# Altium schematic sheet Sheet1.SchDoc
size 381 x 241 mm
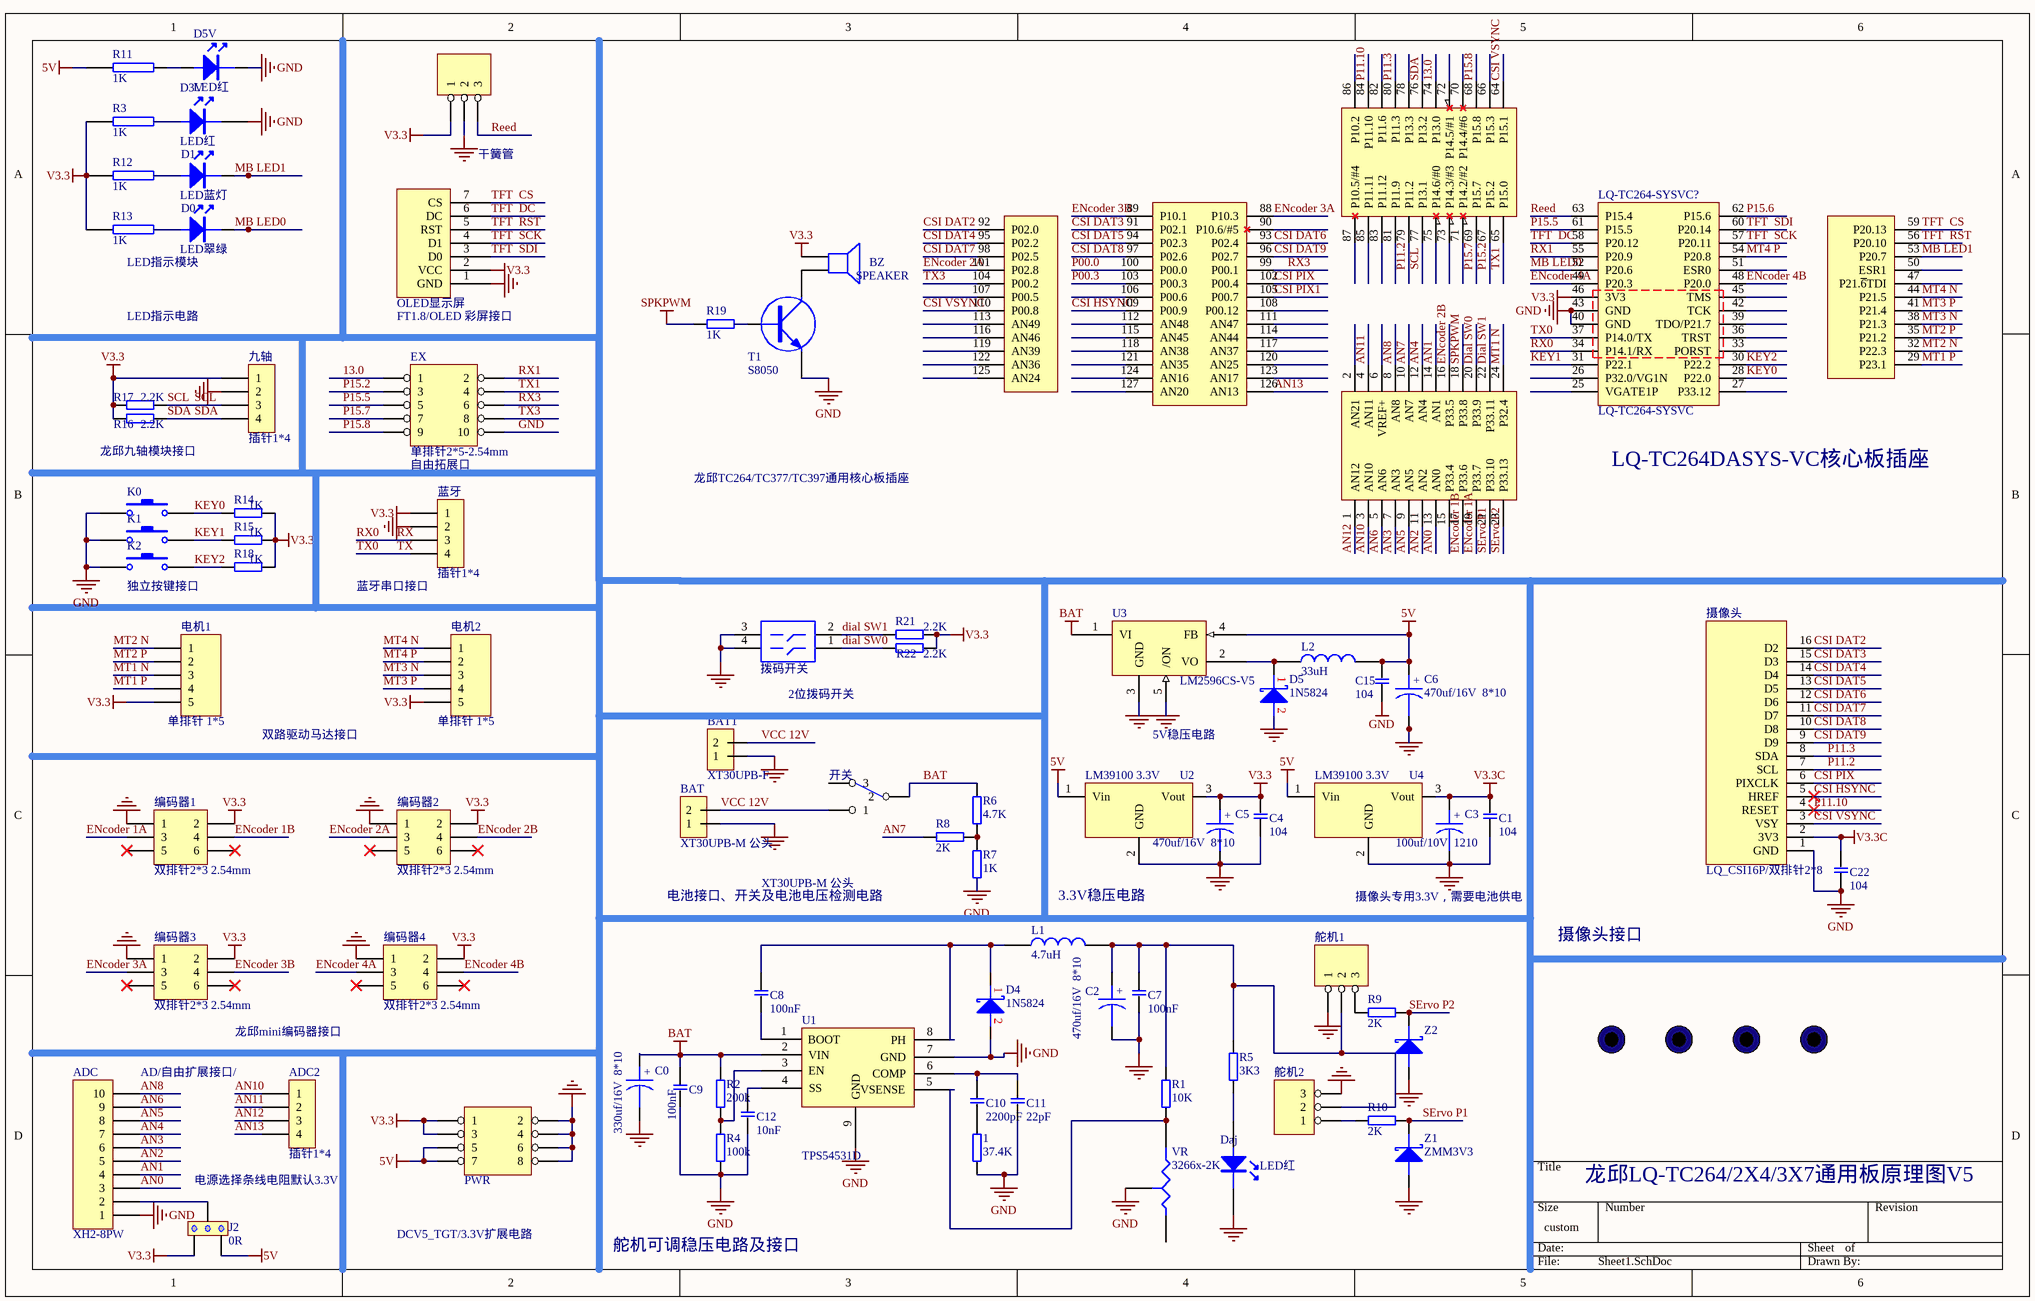
[diagram p0: Sheet1.SchDoc]

## Parts
1  37.4K  [LQ_R0603]
ADC  XH2-8PW  [LQ_IDC5X2]
ADC2  插针1*4  [LQ_XH254-4P]
BAT  XT30UPB-M 公头  [LQ_XT30UPB-F]
BAT1  XT30UPB-F  [LQ_KF301-2P]
BZ  SPEAKER  [LQ_BUZZER9]
C0  330uf/16V  8*10  [LQ_C8X10]
C1  104  [LQ_C0603]
C2  470uf/16V  8*10  [LQ_C8X10]
C3  100uf/10V  1210  [LQ_C8X10]
C4  104  [LQ_C0603]
C5  470uf/16V  8*10  [LQ_C8X10]
C6  470uf/16V  8*10  [LQ_C8X10]
C7  100nF  [LQ_C0603]
C8  100nF  [LQ_C0603]
C9  100nF  [LQ_C0603]
C10  2200pF  [LQ_C0603]
C11  22pF  [LQ_C0603]
C12  10nF  [LQ_C0603]
C15  104  [LQ_C0603]
C22  104  [LQ_C0603]
D0  LED翠绿  [LQ_LED0603R]
D1  LED蓝灯  [LQ_LED0603R]
D3V  LED红  [LQ_LED0603R]
D4  1N5824  [LQ_D1812Z]
D5  1N5824  [LQ_D1812Z]
D5V  LED红  [LQ_LED0603R]
Daj  LED红  [LQ_LED0603R]
EX  单排针2*5-2.54mm  [LQ_IDC5X2]
J2  0R  [LQ_0603JUMP]
K0  微动开关6*6*6  [LQ_BT4SMT]  (value not drawn)
K1  微动开关6*6*6  [LQ_BT4SMT]  (value not drawn)
K2  微动开关6*6*6  [LQ_BT4SMT]  (value not drawn)
L1  4.7uH  [LQ_L7X7]
L2  33uH  [LQ_L7X7]
LQ-TC264-SYSVC?  LQ-TC264-SYSVC  [LQ-TC264-SYSVC-S]
OLED显示屏  单排座1*7-2.54  [LQ-TFT-180V33]  (value not drawn)
PWR  双排针4X2-2.54  [LQ_IDC4X2]  (value not drawn)
R1  10K  [LQ_R0603]
R2  200k  [LQ_R0603]
R3  1K  [LQ_R0603]
R4  100k  [LQ_R0603]
R5  3K3  [LQ_R0603]
R6  4.7K  [LQ_R0603]
R7  1K  [LQ_R0603]
R8  2K  [LQ_R0603]
R9  2K  [LQ_R0603]
R10  2K  [LQ_R0603]
R11  1K  [LQ_R0603]
R12  1K  [LQ_R0603]
R13  1K  [LQ_R0603]
R14  1K  [LQ_R0603]
R15  1K  [LQ_R0603]
R16  2.2K  [LQ_R0603]
R17  2.2K  [LQ_R0603]
R18  1K  [LQ_R0603]
R19  1K  [LQ_R0603]
R21  2.2K  [LQ_R0603]
R22  2.2K  [LQ_R0603]
SCROW1  SCROW  [LQ_SCROW3&5mm]  (value not drawn)
SCROW2  SCROW  [LQ_SCROW3&5mm]  (value not drawn)
SCROW3  SCROW  [LQ_SCROW3&5mm]  (value not drawn)
SCROW4  SCROW  [LQ_SCROW3&5mm]  (value not drawn)
T1  S8050  [LQ_SOT-23NPN]
U1  TPS54531D  [LQ_SOP8S-p]
U2  LM39100 3.3V  [SOT223_M]
U3  LM2596CS-V5  [LQ_TO-263-5]
U4  LM39100 3.3V  [SOT223_M]
VR  3266x-2K  [lq_3266]
Z1  ZMM3V3  [LQ_1206D]
Z2  ZMM3V3  [LQ_1206D]  (value not drawn)
九轴  插针1*4  [LQ_XH254-4P]
干簧管  XH254-3P  [LQ_XH254-3P]  (value not drawn)
开关  KCD1-101 117S  [LQ_KCD1-101 117S]  (value not drawn)
拨码开关  SW-DIP2  [DIP4]  (value not drawn)
摄像头  LQ_CSI16P/双排针2*8  [LQ_IDC8X2]
电机1  XH254-4P  [LQ_XH254-5P]  (value not drawn)
电机2  XH254-4P  [LQ_XH254-5P]  (value not drawn)
编码器1  双排针2*3 2.54mm  [LQ_ENCODER]
编码器2  双排针2*3 2.54mm  [LQ_ENCODER]
编码器3  双排针2*3 2.54mm  [LQ_ENCODER]
编码器4  双排针2*3 2.54mm  [LQ_ENCODER]
舵机1  XH254-3P  [LQ_XH254-3P]  (value not drawn)
舵机2  XH254-3P  [LQ_XH254-3P]  (value not drawn)
蓝牙  插针1*4  [LQ_XH254-4P]

## Nets
5V: C6.1 C15.1 J2.3 L2.2 PWR.5 PWR.7 R11.1 U2.1(Vin) U3.4(FB) U4.1(Vin)
BAT: C0.1 C9.2 R2.1 R6.1 U1.2(VIN) U3.1(VI) 开关.2
GND: 1.2 ADC.1 BAT.1 BAT1.1 C0.2 C1.2 C2.2 C3.2 C4.2 C5.2 C6.2 C7.1 C9.1 C11.1 C12.1 C15.2 C22.2 D3V.2 D4.2 D5.2 D5V.2 Daj.2 EX.10 K0.1 K1.1 K2.1 LQ-TC264-SYSVC?.40(GND) LQ-TC264-SYSVC?.43(GND) OLED显示屏.1(GND) PWR.2 PWR.4 PWR.6 PWR.8 R4.2 R7.2 T1.3(E) U1.7(GND) U1.9(GND) U2.2(GND) U3.3(GND) U3.5(/ON) U4.2(GND) VR.3(TAP) Z1.1 Z2.1 九轴.2 干簧管.2 拨码开关.3 拨码开关.4 摄像头.1(GND) 编码器1.1 编码器2.1 编码器3.1 编码器4.1 舵机1.1 舵机2.3 蓝牙.2
SPKPWM: LQ-TC264-SYSVC?.18(P33.8) R19.1
V3.3: BZ.1 C4.1 C5.1 J2.1 LQ-TC264-SYSVC?.46(3V3) OLED显示屏.2(VCC) PWR.1 PWR.3 R3.1 R12.1 R13.1 R14.2 R15.2 R16.1 R17.1 R18.2 R21.2 R22.2 U2.3(Vout) 九轴.1 干簧管.1 电机1.5 电机2.5 编码器1.2 编码器2.2 编码器3.2 编码器4.2 蓝牙.1
V3.3C: C1.1 C3.1 C22.1 U4.3(Vout) 摄像头.2(3V3)
13.0: EX.1 LQ-TC264-SYSVC?.74(P13.0)
AN0: ADC.3 LQ-TC264-SYSVC?.13(AN0)
AN1: ADC.4 LQ-TC264-SYSVC?.14(AN1)
AN2: ADC.5 LQ-TC264-SYSVC?.11(AN2)
AN3: ADC.6 LQ-TC264-SYSVC?.7(AN3)
AN4: ADC.7 LQ-TC264-SYSVC?.12(AN4)
AN5: ADC.8 LQ-TC264-SYSVC?.9(AN5)
AN6: ADC.9 LQ-TC264-SYSVC?.5(AN6)
AN7: LQ-TC264-SYSVC?.10(AN7) R8.1
AN8: ADC.10 LQ-TC264-SYSVC?.8(AN8)
AN10: ADC2.1 LQ-TC264-SYSVC?.3(AN10)
AN11: ADC2.2 LQ-TC264-SYSVC?.4(AN11)
AN12: ADC2.3 LQ-TC264-SYSVC?.1(AN12)
AN13: ADC2.4 LQ-TC264-SYSVC?.126(AN13)
CSI DAT2: LQ-TC264-SYSVC?.92(P02.0) 摄像头.16(D2)
CSI DAT3: LQ-TC264-SYSVC?.91(P02.1) 摄像头.15(D3)
CSI DAT4: LQ-TC264-SYSVC?.95(P02.2) 摄像头.14(D4)
CSI DAT5: LQ-TC264-SYSVC?.94(P02.3) 摄像头.13(D5)
CSI DAT6: LQ-TC264-SYSVC?.93(P02.4) 摄像头.12(D6)
CSI DAT7: LQ-TC264-SYSVC?.98(P02.5) 摄像头.11(D7)
CSI DAT8: LQ-TC264-SYSVC?.97(P02.6) 摄像头.10(D8)
CSI DAT9: LQ-TC264-SYSVC?.96(P02.7) 摄像头.9(D9)
CSI HSYNC: LQ-TC264-SYSVC?.109(P00.9) 摄像头.5(HREF)
CSI PIX: LQ-TC264-SYSVC?.102(P00.4) 摄像头.6(PIXCLK)
CSI PIX1: LQ-TC264-SYSVC?.105(P00.7)
CSI VSYNC: LQ-TC264-SYSVC?.64(P15.1) LQ-TC264-SYSVC?.110(P00.8) 摄像头.3(VSY)
Dial SW0: LQ-TC264-SYSVC?.20(P33.9) R22.1 拨码开关.1
Dial SW1: LQ-TC264-SYSVC?.22(P33.11) R21.1 拨码开关.2
ENcoder 1A: LQ-TC264-SYSVC?.19(P33.7) 编码器1.3
ENcoder 1B: LQ-TC264-SYSVC?.17(P33.6) 编码器1.4
ENcoder 2A: LQ-TC264-SYSVC?.101(P02.8) 编码器2.3
ENcoder 2B: LQ-TC264-SYSVC?.16(P33.5) 编码器2.4
ENcoder 3A: LQ-TC264-SYSVC?.88(P10.3) 编码器3.3
ENcoder 3B: LQ-TC264-SYSVC?.89(P10.1) 编码器3.4
ENcoder 4A: LQ-TC264-SYSVC?.49(P20.3) 编码器4.3
ENcoder 4B: LQ-TC264-SYSVC?.48(P20.0) 编码器4.4
KEY0: K0.2 LQ-TC264-SYSVC?.28(P22.0) R14.1
KEY1: K1.2 LQ-TC264-SYSVC?.31(P22.1) R15.1
KEY2: K2.2 LQ-TC264-SYSVC?.30(P22.2) R18.1
MB LED0: D0.2 LQ-TC264-SYSVC?.52(P20.6)
MB LED1: D1.2 LQ-TC264-SYSVC?.53(P20.7)
MT1 N: LQ-TC264-SYSVC?.24(P32.4) 电机1.3
MT1 P: LQ-TC264-SYSVC?.29(P23.1) 电机1.4
MT2 N: LQ-TC264-SYSVC?.32(P22.3) 电机1.1
MT2 P: LQ-TC264-SYSVC?.35(P21.2) 电机1.2
MT3 N: LQ-TC264-SYSVC?.38(P21.3) 电机2.3
MT3 P: LQ-TC264-SYSVC?.41(P21.4) 电机2.4
MT4 N: LQ-TC264-SYSVC?.44(P21.5) 电机2.1
MT4 P: LQ-TC264-SYSVC?.54(P20.8) 电机2.2
P00.0: LQ-TC264-SYSVC?.100(P00.0)
P00.3: LQ-TC264-SYSVC?.103(P00.3)
P11.2: LQ-TC264-SYSVC?.79(P11.2) 摄像头.7(SCL)
P11.3: LQ-TC264-SYSVC?.80(P11.3) 摄像头.8(SDA)
P11.10: LQ-TC264-SYSVC?.84(P11.10) 摄像头.4(RESET)
P15.2: EX.3 LQ-TC264-SYSVC?.67(P15.2)
P15.5: EX.5 LQ-TC264-SYSVC?.61(P15.5)
P15.6: LQ-TC264-SYSVC?.62(P15.6)
P15.7: EX.7 LQ-TC264-SYSVC?.69(P15.7)
P15.8: EX.9 LQ-TC264-SYSVC?.68(P15.8)
Reed: LQ-TC264-SYSVC?.63(P15.4) 干簧管.3
RX: LQ-TC264-SYSVC?.34(P14.1/RX) 蓝牙.3  [also labelled RX0]
RX1: EX.2 LQ-TC264-SYSVC?.55(P20.9)
RX3: EX.6 LQ-TC264-SYSVC?.99(P00.1)
SCL: LQ-TC264-SYSVC?.77(P13.1) R17.2 九轴.3
SDA: LQ-TC264-SYSVC?.76(P13.2) R16.2 九轴.4
SErvo P1: LQ-TC264-SYSVC?.21(P33.10) R10.2 Z1.2
SErvo P2: LQ-TC264-SYSVC?.23(P33.13) R9.2 Z2.2
TFT  CS: LQ-TC264-SYSVC?.59(P20.13) OLED显示屏.7(CS)
TFT  DC: LQ-TC264-SYSVC?.58(P20.12) OLED显示屏.6(DC)
TFT  RST: LQ-TC264-SYSVC?.56(P20.10) OLED显示屏.5(RST)
TFT  SCK: LQ-TC264-SYSVC?.57(P20.11) OLED显示屏.4(D1)
TFT  SDI: LQ-TC264-SYSVC?.60(P20.14) OLED显示屏.3(D0)
TX: LQ-TC264-SYSVC?.37(P14.0/TX) 蓝牙.4  [also labelled TX0]
TX1: EX.4 LQ-TC264-SYSVC?.65(P15.0)
TX3: EX.8 LQ-TC264-SYSVC?.104(P00.2)
VCC 12V: BAT.2 BAT1.2 开关.1
Net1_1: 1.1 C10.1
NetADC_2: ADC.2 J2.2
NetBZ_2: BZ.2 T1.2(C)
NetC2_1: C2.1 C7.2 L1.2 R1.1 R5.1 舵机1.2 舵机2.2
NetC8_1: C8.1 U1.1(BOOT)
NetC8_2: C8.2 D4.1 L1.1 U1.8(PH)
NetC10_2: C10.2 C11.2 U1.6(COMP)
NetC12_2: C12.2 U1.4(SS)
NetD0_1: D0.1 R13.2
NetD1_1: D1.1 R12.2
NetD3V_1: D3V.1 R3.2
NetD5_1: D5.1 L2.1 U3.2(VO)
NetD5V_1: D5V.1 R11.2
NetDaj_1: Daj.1 R5.2
NetR1_2: R1.2 U1.5(VSENSE) VR.2(B)
NetR2_2: R2.2 R4.1 U1.3(EN)
NetR6_2: R6.2 R7.1 R8.2
NetR9_1: R9.1 舵机1.3
NetR10_1: R10.1 舵机2.1
NetR19_2: R19.2 T1.1(B)

Not connected (* = marked no-connect by the designer): LQ-TC264-SYSVC? 2(AN21) 6(VREF+) 15(P33.4) 25(VGATE1P) 26(P32.0/VG1N) 27(P33.12) 33(PORST) 36(TRST) 39(TDO/P21.7) 42(TCK) 45(TMS) 47(P21.~{6}TDI) 50(ESR1) 51(ESR0) 66(P15.3) 70(P14.4/#6) 71(P14.2/#2) 72(P14.5/#1) 73(P14.3/#3) 75(P14.6/#0) 78(P13.3) 81(P11.9) 82(P11.6) 83(P11.12) 85(P11.11) 86(P10.2) 87(P10.5/#4) 90(P10.6/#5) 106(P00.6) 107(P00.5) 108(P00.12) 111(AN47) 112(AN48) 113(AN49) 114(AN44) 115(AN45) 116(AN46) 117(AN37) 118(AN38) 119(AN39) 120(AN25) 121(AN35) 122(AN36) 123(AN17) 124(AN16) 125(AN24) 127(AN20); SCROW1 1; SCROW2 1; SCROW3 1; SCROW4 1; VR 1(A); 开关 3; 编码器1 5* 6*; 编码器2 5* 6*; 编码器3 5* 6*; 编码器4 5* 6*

## Notes on the sheet
- LED指示模块
- LED指示电路
- (near OLED显示屏) FT1.8/OLED 彩屏接口
- 龙邱九轴模块接口
- 自由拓展口
- 龙邱TC264/TC377/TC397通用核心板插座
- (near LQ-TC264-SYSVC?) LQ-TC264DASYS-VC核心板插座
- (near K2) 独立按键接口
- 蓝牙串口接口
- (near 拨码开关) 2位拨码开关
- (near 电机1) 单排针 1*5
- 双路驱动马达接口
- (near 电机2) 单排针 1*5
- 5V稳压电路
- 电池接口、开关及电池电压检测电路
- XT30UPB-M 公头
- 3.3V稳压电路
- 摄像头专用3.3V，需要电池供电
- 摄像头接口
- 龙邱mini编码器接口
- (near ADC) AD/自由扩展接口/
- 电源选择条线电阻默认3.3V
- 龙邱LQ-TC264/2X4/3X7通用板原理图V5
- DCV5_TGT/3.3V扩展电路
- 舵机可调稳压电路及接口
- (in symbol CAPACITOR POL) +

## Library data of the parts
1 R1 R2 R4-R10 R14-R19 R21 R22 = LQ_RES: RES
ADC = CON10: Connector
ADC2 九轴 蓝牙 = CON4: Connector
BAT BAT1 = LQ_PIN2: Jumper
C0 C2 C3 C5 C6 = CAPACITOR POL: Capacitor
C1 C4 C7-C12 C15 C22 = LQ_CAP: CAP
D0 D1 D3V D5V Daj = LED
D4 D5 = LQ_Z: Schottky Diode
EX = HEADER 5X2
J2 = LQ_JUMPER3: Jumper
K0-K2 = 微动开关
L1 L2 = INDUCTOR
OLED显示屏 = LQ_OLED128X64
PWR = HEADER 4X2
R3 R11-R13 = RES2
SCROW1-SCROW4 = SCROW: Connector
T1 = NPN: NPN Transistor
U1 = 54531
U2 U4 = VOLTREG
U3 = LM2575T
VR = RESISTOR TAPPED
Z1 Z2 = LQ_D: Schottky Diode
干簧管 舵机1 舵机2 = HEADER 3
开关 = LQ_SWMTS102
摄像头 = LQ_CSI16P
电机1 电机2 = Header 5: Header, 5-Pin; LatestRevisionDate: 17-Jul-2002; LatestRevisionNote: Re-released for DXP Platform.; Publisher: Altium Limited
编码器1-编码器4 = Header 3X2: Header, 3-Pin, Dual row; LatestRevisionDate: 17-Jul-2002; LatestRevisionNote: Re-released for DXP Platform.; Publisher: Altium Limited